# Altium schematic sheet Power7V4.SchDoc
size 441 x 172 mm; SheetNumber: 1; SheetTotal: 1
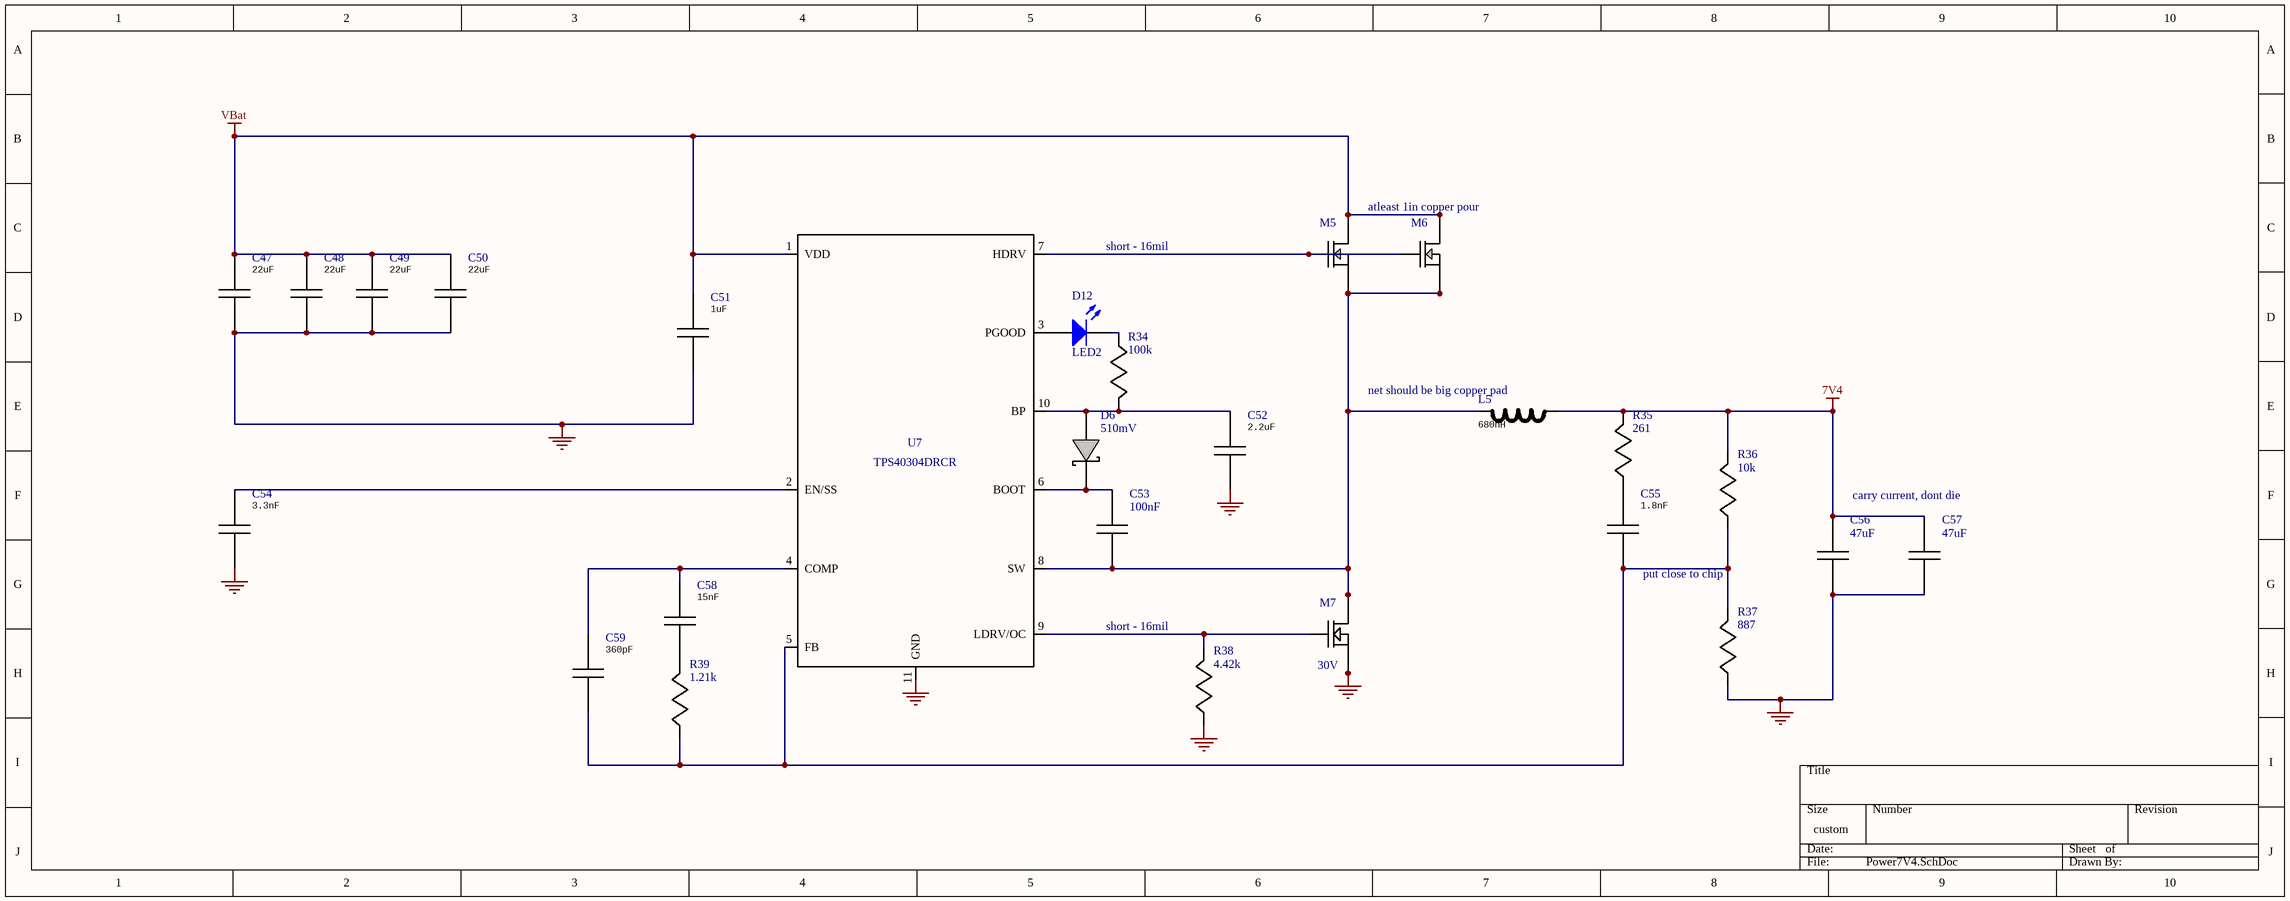
[diagram p0: Power7V4.SchDoc]

## Parts
C47  value 22uF  [1210]  (hidden comment: GRM32ER61E226KE1)
C48  value 22uF  [1210]  (hidden comment: GRM32ER61E226KE1)
C49  value 22uF  [1210]  (hidden comment: GRM32ER61E226KE1)
C50  value 22uF  [1210]  (hidden comment: GRM32ER61E226KE1)
C51  value 1uF  [1608]  (hidden comment: GRM188R61E105KA1)
C52  value 2.2uF  [1608]  (hidden comment: GRM188R61A225KE3)
C53  value 100nF  [1608]  (hidden comment: 08053C104KAT2A)
C54  value 3.3nF  [1608]  (hidden comment: GRM033R71C332KA8)
C55  value 1.8nF  [1608]  (hidden comment: GRM155R71H182KA0)
C56  value 47uF  [1206]  (hidden comment: C3216X6S1A476M)
C57  value 47uF  [1206]  (hidden comment: C3216X6S1A476M)
C58  value 15nF  [1608]  (hidden comment: CC0805KRX7R9BB15)
C59  value 360pF  [1608]  (hidden comment: GRM1555C1H361JA0)
D6  value 510mV  [SOD-123]  (hidden comment: MBR0540T1G)
D12  LED2  [1608[0603]]
L5  value 680nH  [XAL1010]  (hidden comment: XAL1010-681MEB)
M5  CSD16340Q3  [TRANS_NexFET_Q3]  (value not drawn)
M6  CSD16340Q3  [TRANS_NexFET_Q3]  (value not drawn)
M7  value 30V  [PG-TSDSON-8]  (hidden comment: BSZ050N03MS G)
R34  value 100k  [1608]  (hidden comment: CRCW0402100KFKED)
R35  value 261  [1608]  (hidden comment: CRCW0402261RFKED)
R36  value 10k  [1608]  (hidden comment: CRCW040210K0FKED)
R37  value 887  [1608]  (hidden comment: CRCW0402887RFKED)
R38  value 4.42k  [1608]  (hidden comment: CRCW04024K42FKED)
R39  value 1.21k  [1608]  (hidden comment: CRCW04021K21FKED)
U7  TPS40304DRCR  [S-PVSON-N10]

## Nets
7V4: C56.1 C57.1 L5.2 R35.1 R36.1
GND: C47.2 C48.2 C49.2 C50.2 C51.2 C52.2 C54.2 C56.2 C57.2 M7.1(Source) M7.2(Source) M7.3(Source) R37.2 R38.2 U7.11(GND)
VBat: C47.1 C48.1 C49.1 C50.1 C51.1 M5.5(Drain) M5.6(Drain) M5.7(Drain) M5.8(Drain) M5.9(Drain) M6.5(Drain) M6.6(Drain) M6.7(Drain) M6.8(Drain) M6.9(Drain) U7.1(VDD)
NetC52_1: C52.1 D6.2(A) R34.1 U7.10(BP)
NetC53_1: C53.1 D6.1(K) U7.6(BOOT)
NetC53_2: C53.2 L5.1 M5.1(Source) M5.2(Source) M5.3(Source) M6.1(Source) M6.2(Source) M6.3(Source) M7.5(Drain) M7.6(Drain) M7.7(Drain) M7.8(Drain) M7.9(Drain) U7.8(SW)
NetC54_1: C54.1 U7.2(EN/SS)
NetC55_1: C55.1 R35.2
NetC55_2: C55.2 C59.1 R36.2 R37.1 R39.2 U7.5(FB)
NetC58_1: C58.1 R39.1
NetC58_2: C58.2 C59.2 U7.4(COMP)
NetD12_1: D12.1(A) U7.3(PGOOD)
NetD12_2: D12.2(K) R34.2
NetM5_4: M5.4(Gate) M6.4(Gate) U7.7(HDRV)
NetM7_4: M7.4(Gate) R38.1 U7.9(LDRV/OC)

## Notes on the sheet
- short - 16mil
- (near M6) atleast 1in copper pour
- (near L5) net should be big copper pad
- carry current, dont die
- put close to chip
- (near R38) short - 16mil

## Library data of the parts
C47-C50 = GRM32ER61E226KE1: Imported; Manufacturer_Part_Number: GRM32ER61E226KE15L; Vendor: MuRata; Manufacturer_Name: MuRata; RefDes: RefDes; TYPE: TYPE
C51 = GRM188R61E105KA1: Imported; Manufacturer_Part_Number: GRM188R61E105KA12D; Vendor: MuRata; rn: Cvcc; Manufacturer_Name: MuRata; RefDes: RefDes; TYPE: TYPE
C52 = GRM188R61A225KE3: Imported; Manufacturer_Part_Number: GRM188R61A225KE34D; Vendor: MuRata; rn: Cbyp; Manufacturer_Name: MuRata; RefDes: RefDes; TYPE: TYPE
C53 = 08053C104KAT2A: Manufacturer Name: AVX; rn: Cbst; PackageReference: 08053C104KAT2A; Manufacturer Part Number: 08053C104KAT2A
C54 = GRM033R71C332KA8: Imported; Manufacturer_Part_Number: GRM033R71C332KA88D; Vendor: MuRata; rn: Css; Manufacturer_Name: MuRata; RefDes: RefDes; TYPE: TYPE
C55 = GRM155R71H182KA0: Imported; Manufacturer_Part_Number: GRM155R71H182KA01D; Vendor: MuRata; rn: Ccomp3; Manufacturer_Name: MuRata; RefDes: RefDes; TYPE: TYPE
C56 = C3216X6S1A476M: Manufacturer Name: TDK; rn: Cout; PackageReference: C3216X6S1A476M; Manufacturer Part Number: C3216X6S1A476M
C57 = C3216X6S1A476M: Manufacturer Name: TDK; rn: Cout_2; PackageReference: C3216X6S1A476M; Manufacturer Part Number: C3216X6S1A476M
C58 = CC0805KRX7R9BB15: Imported; Manufacturer_Part_Number: CC0805KRX7R9BB153; Vendor: Yageo America; rn: Ccomp; Manufacturer_Name: Yageo America; RefDes: RefDes; TYPE: TYPE
C59 = GRM1555C1H361JA0: Imported; Manufacturer_Part_Number: GRM1555C1H361JA01D; Vendor: MuRata; rn: Ccomp2; Manufacturer_Name: MuRata; RefDes: RefDes; TYPE: TYPE
D6 = MBR0540T1G: Manufacturer Name: ON Semiconductor; rn: Ds; PackageReference: MBR0540T1G; Manufacturer Part Number: MBR0540T1G
D12 = LED2: Typical RED, GREEN, YELLOW, AMBER GaAs LED; Published: 8-Jun-2000; LatestRevisionDate: 17-Jul-2002; LatestRevisionNote: Re-released for DXP Platform.; PackageVersion: Feb-2002; PackageReference: 3.2X1.6X1.1; Publisher: Altium Limited; PackageDescription: SM LED; 2 Flat Leads
L5 = XAL1010-681MEB: Imported; Manufacturer_Part_Number: XAL1010-451MEB; Vendor: Coilcraft; Manufacturer_Name: Coilcraft; RefDes: RefDes; TYPE: TYPE
M5 M6 = CSD16340Q3: Imported; Vendor: Texas Instruments; Value: Value; Manufacturer_Part_Number: CSD16340Q3; Manufacturer_Name: Texas Instruments; RefDes: RefDes; TYPE: TYPE
M7 = BSZ050N03MS G: Manufacturer Name: Infineon Technologies; PackageReference: BSZ050N03MS G; Manufacturer Part Number: BSZ050N03MS G
R34 = CRCW0402100KFKED: Manufacturer Name: Vishay-Dale; rn: Rpgood; PackageReference: CRCW0402100KFKED; Manufacturer Part Number: CRCW0402100KFKED
R35 = CRCW0402261RFKED: Manufacturer Name: Vishay-Dale; rn: Rcomp2; PackageReference: CRCW0402261RFKED; Manufacturer Part Number: CRCW0402261RFKED
R36 = CRCW040210K0FKED: Manufacturer Name: Vishay-Dale; rn: Rfbt; PackageReference: CRCW040210K0FKED; Manufacturer Part Number: CRCW040210K0FKED
R37 = CRCW0402887RFKED: Manufacturer Name: Vishay-Dale; rn: Rfbb; PackageReference: CRCW0402887RFKED; Manufacturer Part Number: CRCW0402887RFKED
R38 = CRCW04024K42FKED: Manufacturer Name: Vishay-Dale; rn: Rs; PackageReference: CRCW04024K42FKED; Manufacturer Part Number: CRCW04024K42FKED
R39 = CRCW04021K21FKED: Manufacturer Name: Vishay-Dale; rn: Rcomp; PackageReference: CRCW04021K21FKED; Manufacturer Part Number: CRCW04021K21FKED
U7 = TPS40304DRCR: Manufacturer Name: Texas Instruments; Value: UNLISTED; PackageReference: TPS40304DRCR; Manufacturer Part Number: TPS40304DRCR